# EAGLE design mc_board_with_leds (EAGLE 7.5.0)
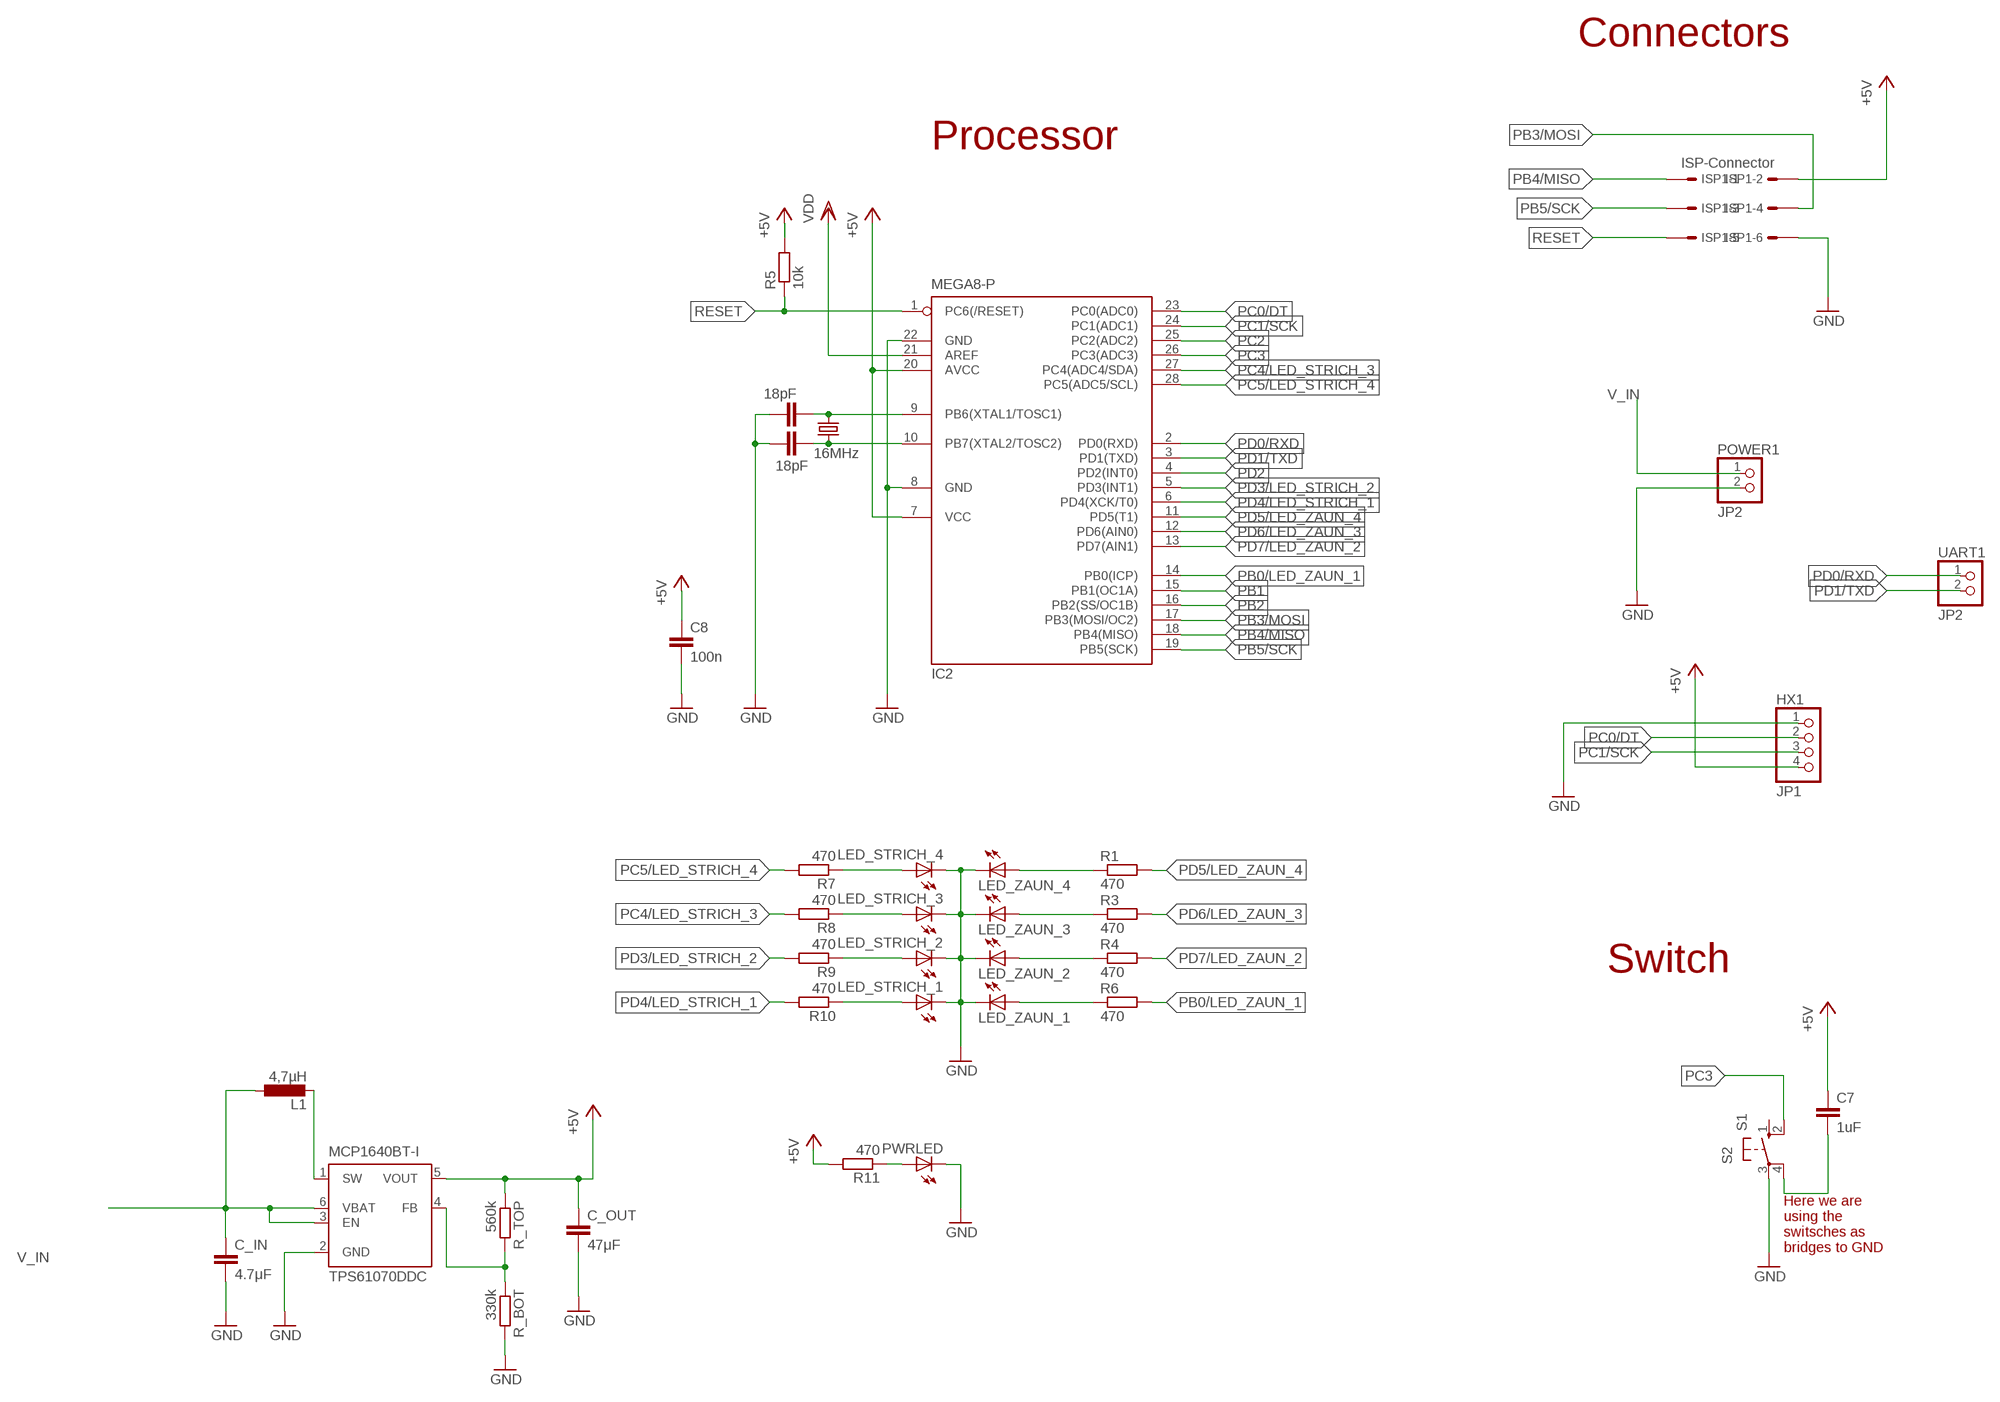
[diagram p0: schematic, sheet 1]

## Parts
C5  18pF  C-EUC0805K  [C0805K]
C6  18pF  C-EUC0805K  [C0805K]
C7  1uF  C-EUC0805  [C0805]
C8  100n  C-EUC0805  [C0805]
C_IN  4.7μF  C-EUC0805  [C0805]
C_OUT  47μF  C-EUC0805  [C0805]
HX1  JP1  PINHD-1X4  [1X04]
IC2  MEGA8-P  [DIL28-3]
ISP1  ISP-Connector  057-006-1  [057-006-1]
L1  4,7µH  L-EUL4532P  [L4532P]
LED_STRICH_1  LED3MM  [LED3MM]
LED_STRICH_2  LED3MM  [LED3MM]
LED_STRICH_3  LED3MM  [LED3MM]
LED_STRICH_4  LED3MM  [LED3MM]
LED_ZAUN_1  LED3MM  [LED3MM]
LED_ZAUN_2  LED3MM  [LED3MM]
LED_ZAUN_3  LED3MM  [LED3MM]
LED_ZAUN_4  LED3MM  [LED3MM]
MCP1640BT-I  TPS61070DDC  [TSOT23-6_DDC]
POWER1  JP2  PINHD-1X2  [1X02]
PWRLED  LED3MM  [LED3MM]
Q2  16MHz  CRYSTALHC49S  [HC49/S]
R1  470  R-EU_R0805  [R0805]
R3  470  R-EU_R0805  [R0805]
R4  470  R-EU_R0805  [R0805]
R5  10k  R-EU_R1206  [R1206]
R6  470  R-EU_R0805  [R0805]
R7  470  R-EU_R0805  [R0805]
R8  470  R-EU_R0805  [R0805]
R9  470  R-EU_R0805  [R0805]
R10  470  R-EU_R0805  [R0805]
R11  470  R-EU_R0805  [R0805]
R_BOT  330k  R-EU_R0805  [R0805]
R_TOP  560k  R-EU_R0805  [R0805]
S2  S1  10-XX  [B3F-10XX]
UART1  JP2  PINHD-1X2  [1X02]

## Nets
+5V: C7.1 C8.1 C_OUT.1 HX1.4 IC2.7(VCC) IC2.20(AVCC) ISP1.2 MCP1640BT-I.5(VOUT) R5.2 R11.2 R_TOP.1
GND: C5.2 C6.2 C8.2 C_IN.2 C_OUT.2 HX1.1 IC2.8(GND) IC2.22(GND) ISP1.6 LED_STRICH_1.K(C) LED_STRICH_2.K(C) LED_STRICH_3.K(C) LED_STRICH_4.K(C) LED_ZAUN_1.K(C) LED_ZAUN_2.K(C) LED_ZAUN_3.K(C) LED_ZAUN_4.K(C) MCP1640BT-I.2(GND) POWER1.2 PWRLED.K(C) R_BOT.2 S2.3(P)
N$1: LED_ZAUN_4.A R1.1
N$2: LED_ZAUN_3.A R3.1
N$3: LED_ZAUN_2.A R4.1
N$4: C5.1 IC2.10(PB7(XTAL2/TOSC2)) Q2.2
N$5: L1.2 MCP1640BT-I.1(SW)
N$6: MCP1640BT-I.4(FB) R_BOT.1 R_TOP.2
N$7: LED_ZAUN_1.A R6.1
N$8: LED_STRICH_4.A R7.1
N$10: LED_STRICH_3.A R8.1
N$11: LED_STRICH_2.A R9.1
N$12: LED_STRICH_1.A R10.1
N$13: PWRLED.A R11.1
N$14: C6.1 IC2.9(PB6(XTAL1/TOSC1)) Q2.1
N$15: C7.2 S2.4(P1)
PB0/LED_ZAUN_1: IC2.14(PB0(ICP)) R6.2
PB1: IC2.15(PB1(OC1A))
PB2: IC2.16(PB2(SS/OC1B))
PB3/MOSI: IC2.17(PB3(MOSI/OC2)) ISP1.4
PB4/MISO: IC2.18(PB4(MISO)) ISP1.1
PB5/SCK: IC2.19(PB5(SCK)) ISP1.3
PC0/DT: HX1.2 IC2.23(PC0(ADC0))
PC1/SCK: HX1.3 IC2.24(PC1(ADC1))
PC2: IC2.25(PC2(ADC2))
PC3: IC2.26(PC3(ADC3)) S2.2(S1)
PC4/LED_STRICH_3: IC2.27(PC4(ADC4/SDA)) R8.2
PC5/LED_STRICH_4: IC2.28(PC5(ADC5/SCL)) R7.2
PD0/RXD: IC2.2(PD0(RXD)) UART1.1
PD1/TXD: IC2.3(PD1(TXD)) UART1.2
PD2: IC2.4(PD2(INT0))
PD3/LED_STRICH_2: IC2.5(PD3(INT1)) R9.2
PD4/LED_STRICH_1: IC2.6(PD4(XCK/T0)) R10.2
PD5/LED_ZAUN_4: IC2.11(PD5(T1)) R1.2
PD6/LED_ZAUN_3: IC2.12(PD6(AIN0)) R3.2
PD7/LED_ZAUN_2: IC2.13(PD7(AIN1)) R4.2
RESET: IC2.1(PC6(/RESET)) ISP1.5 R5.1
V_IN: C_IN.1 L1.1 MCP1640BT-I.3(EN) MCP1640BT-I.6(VBAT) POWER1.1
VDD: IC2.21(AREF)
Unconnected: S2.1(S)

## Notes on the sheet
- Connectors
- Processor
- Switch
- Here we are
  using the 
  switsches as
  bridges to GND

## Library data of the parts
C5 C6 = resistor:C-EU: CAPACITOR, European symbol
C7 C8 C_IN C_OUT = rcl-2:C-EU: CAPACITOR, European symbol
HX1 = pinhead:PINHD-1X4: PIN HEADER
IC2 = atmel:MEGA8-P: MICROCONTROLLER 8 Kbytes FLASH, 1 kbytes SRAM, 512 bytes EEPROM, USART, 4-channel 10 bit ADC, 2-channel 8 bit ADC Pin compatible with Atmega48, ATMega88, ATMega168 Source: avr.lbr; OC_FARNELL: unknown; OC_NEWARK: unknown
ISP1 = con-panduit:057-006-: CONNECTOR 6-pin series 057 contact pc board low profile headers; OC_FARNELL: unknown; OC_NEWARK: unknown
L1 = rcl:L-EU: INDUCTOR, European symbol
LED_STRICH_1-LED_STRICH_4 LED_ZAUN_1-LED_ZAUN_4 PWRLED = led:LED: LED OSRAM: - CHIPLED LG R971, LG N971, LY N971, LG Q971, LY Q971, LO R971, LY R971 LH N974, LH R974 LS Q976, LO Q976, LY Q976 LO Q996 - Hyper CHIPLED LW Q18S LB Q993, LB Q99A, LB R99A - SideLED LS A670, LO A670, LY A670, LG A670, LP A670 LB A673, LV A673, LT A673, LW A673 LH A674 LY A675 LS A676, LA A676, LO A676, LY A676, LW A676 LS A679, LY A679, LG A679 - Hyper Micro SIDELED® LS Y876, LA Y876, LO Y876, LY Y876 LT Y87S - SmartLED LW L88C, LW L88S LB L89C, LB L89S, LG L890 LS L89K, LO L89K, LY L89K LS L896, LA L896, LO L896, LY L896 - TOPLED LS T670, LO T670, LY T670, LG T670, LP T670 LSG T670, LSP T670, LSY T670, LOP T670, LYG T670 LG T671, LOG T671, LSG T671 LB T673, LV T673, LT T673, LW T673 LH T674 LS T676, LA T676, LO T676, LY T676, LB T676, LH T676, LSB T676, LW T676 LB T67C, LV T67C, LT T67C, LS T67K, LO T67K, LY T67K, LW E67C LS E67B, LA E67B, LO E67B, LY E67B, LB E67C, LV E67C, LT E67C LW T67C LS T679, LY T679, LG T679 LS T770, LO T770, LY T770, LG T770, LP T770 LB T773, LV T773, LT T773, LW T773 LH T774 LS E675, LA E675, LY E675, LS T675 LS T776, LA T776, LO T776, LY T776, LB T776 LHGB T686 LT T68C, LB T68C - Hyper Mini TOPLED® LB M676 - Mini TOPLED Santana® LG M470 LS M47K, LO M47K, LY M47K Source: http://www.osram.convergy.de LUXEON: - LUMILED® LXK2-PW12-R00, LXK2-PW12-S00, LXK2-PW14-U00, LXK2-PW14-V00 LXK2-PM12-R00, LXK2-PM12-S00, LXK2-PM14-U00 LXK2-PE12-Q00, LXK2-PE12-R00, LXK2-PE12-S00, LXK2-PE14-T00, LXK2-PE14-U00 LXK2-PB12-K00, LXK2-PB12-L00, LXK2-PB12-M00, LXK2-PB14-N00, LXK2-PB14-P00, LXK2-PB14-Q00 LXK2-PR12-L00, LXK2-PR12-M00, LXK2-PR14-Q00, LXK2-PR14-R00 LXK2-PD12-Q00, LXK2-PD12-R00, LXK2-PD12-S00 LXK2-PH12-R00, LXK2-PH12-S00 LXK2-PL12-P00, LXK2-PL12-Q00, LXK2-PL12-R00 Source: www.luxeon.com KINGBRIGHT: KA-3528ASYC Source: www.kingbright.com
MCP1640BT-I = texas:TPS6107*: 90% EFFICIENT SYNCHRONOUS BOOST CONVERTER WITH 600-mA SWITCH Source: http://focus.ti.com/lit/ds/symlink/tps61070.pdf; MPN: TPS61070DDCR; OC_FARNELL: 1461062; OC_NEWARK: 64M3125
POWER1 UART1 = pinhead:PINHD-1X2: PIN HEADER
Q2 = crystal:CRYSTAL: CRYSTAL; OC_FARNELL: 1667008; OC_NEWARK: unknown
R1 R3 R4 R6-R11 R_BOT R_TOP = resistor:R-EU_: RESISTOR, European symbol
R5 = rcl-2:R-EU_: RESISTOR, European symbol
S2 = switch-omron:10-XX: OMRON SWITCH; MPN: B3F-1000; OC_FARNELL: 176432; OC_NEWARK: 36M3542

## Board
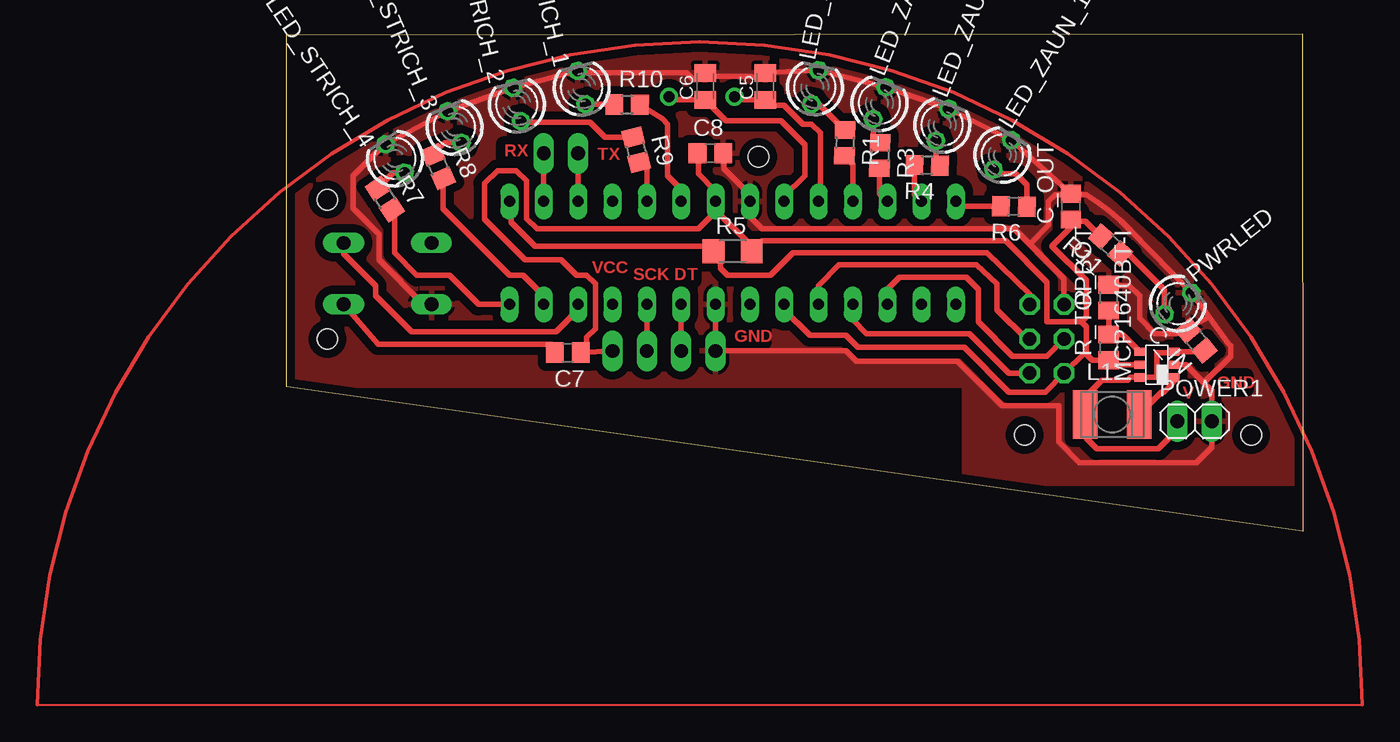
[diagram p1: board, top side]
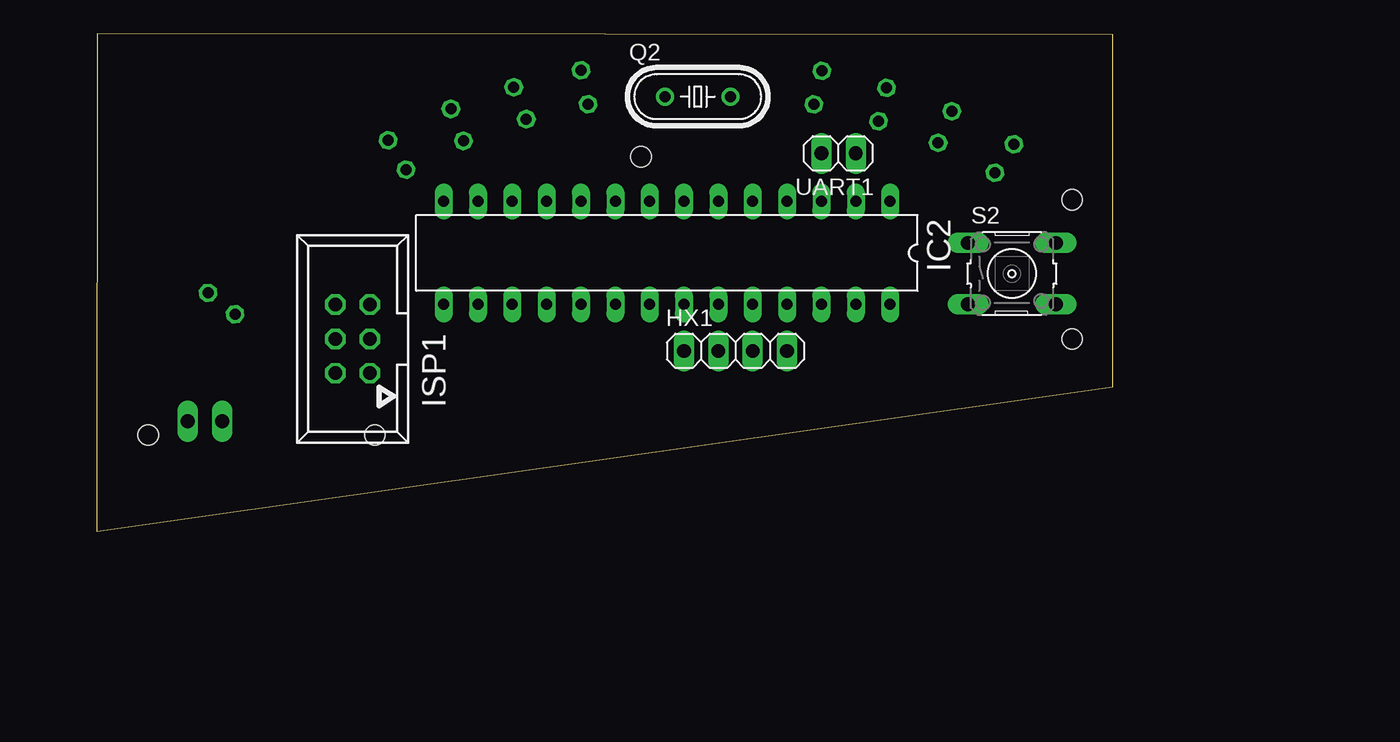
[diagram p2: board, bottom side, seen from below]

Size 75.15 x 36.76 mm. Coordinates in mm from the lower left corner, seen from the top.
Outline: 0,10.66 0.02,36.68 75.12,36.76 75.15,0 0,10.66
Copper layers (1*16): Top 0.035mm / dielectric 1.5mm / Bottom 0.035mm
Design rules "default *": minimum track width 10mil, minimum drill 24mil, track to track 8mil, track to pad 8mil, pad to pad 8mil, via to via 8mil, smd to smd 8mil, copper to edge 25mil, drill to drill 8mil, minimum pad ring 10mil, minimum via ring 8mil, stop-mask expansion 4mil, vias tented up to drill 0mil, thermal gap 10mil
Holes 1.5 mm at 3.02,24.5 71.35,7.1 54.58,7.1 3.02,14.21 34.9,27.67

### Footprints (pad centres in the part's own frame; a part is rotated, then mirrored left to right if it is on the bottom)
C0805K = smd 1.3 x 1.6: 1 -1,0; 2 1,0
C0805 = smd 1.3 x 1.5: 1 -0.95,0; 2 0.95,0
1X04 = drill 1.016 long: 1 -3.81,0; 2 -1.27,0; 3 1.27,0; 4 3.81,0
DIL28-3 = drill 0.813 long: 1 -16.51,-3.81; 2 -13.97,-3.81; 3 -11.43,-3.81; 4 -8.89,-3.81; 5 -6.35,-3.81; 6 -3.81,-3.81; 7 -1.27,-3.81; 8 1.27,-3.81; 9 3.81,-3.81; 10 6.35,-3.81; 11 8.89,-3.81; 12 11.43,-3.81; 13 13.97,-3.81; 14 16.51,-3.81; 15 16.51,3.81; 16 13.97,3.81; 17 11.43,3.81; 18 8.89,3.81; 19 6.35,3.81; 20 3.81,3.81; 21 1.27,3.81; 22 -1.27,3.81; 23 -3.81,3.81; 24 -6.35,3.81; 25 -8.89,3.81; 26 -11.43,3.81; 27 -13.97,3.81; 28 -16.51,3.81
057-006-1 = drill 1 octagon: 1 -2.54,-1.27; 2 -2.54,1.27; 3 0,-1.27; 4 0,1.27; 5 2.54,-1.27; 6 2.54,1.27
L4532P = smd 1.8 x 3.6: 1 -2,0; 2 2,0
LED3MM = drill 0.813 octagon: A -1.27,0; K 1.27,0
TSOT23-6_DDC = smd 0.6 x 0.8: 1 -0.95,-1.25; 2 0,-1.25; 3 0.95,-1.25; 4 0.95,1.25; 5 0,1.25; 6 -0.95,1.25
1X02 = drill 1.016 long: 1 -1.27,0; 2 1.27,0
HC49/S = drill 0.813: 1 2.413,0; 2 -2.413,0
R0805 = smd 1.3 x 1.5: 1 -0.95,0; 2 0.95,0
R1206 = smd 1.6 x 1.803: 1 -1.422,0; 2 1.422,0
B3F-10XX = drill 1.016 long: 1 -3.251,2.261; 2 3.251,2.261; 3 -3.251,-2.261; 4 3.251,-2.261

### Placement (x,y rotation side)
C5  35.41,32.88 90 top
C6  30.96,32.88 90 top
C7  20.8,13.19 180 top
C8  31.34,27.93 0 top
C_IN  67.28,14.08 130 top
C_OUT  58.01,23.99 90 top
HX1  27.91,13.32 0 bottom
IC2  32.99,20.56 180 bottom
ISP1  56.24,14.21 90 bottom
L1  61.06,8.62 0 top
LED_STRICH_1  21.83,32.78 103.6 top
LED_STRICH_2  17.04,31.53 103.6 top
LED_STRICH_3  12.42,29.87 113.6 top
LED_STRICH_4  8.02,27.54 123.6 top
LED_ZAUN_1  52.95,27.81 58.6 top
LED_ZAUN_2  48.5,30.03 68.6 top
LED_ZAUN_3  43.86,31.64 68.6 top
LED_ZAUN_4  39.08,32.82 78.6 top
MCP1640BT-I  64.36,12.31 90 top
POWER1  67.16,8.11 0 top
PWRLED  65.93,16.82 38.6 top
Q2  30.71,32.12 0 bottom
R1  41.28,28.7 268.6 top
R3  43.88,27.77 268.6 top
R4  47.37,27.04 178.6 top
R5  32.99,20.69 0 top
R6  53.79,24 178.6 top
R7  7.27,24.55 303.6 top
R8  11.2,26.96 293.6 top
R9  25.86,28.19 283.6 top
R10  25.19,31.53 359.6 top
R11  60.94,21.15 138.6 top
R_BOT  60.81,17.26 90 top
R_TOP  60.81,13.58 90 top
S2  7.47,19.04 0 bottom
UART1  20.29,27.93 180 bottom

### Tracks (layer width: path | path; a pad name or v marks a point on that pad's centre or on a via)
+5V
  Top 0.406: 31.72,23.61 IC2.7 31.72,25.13 30.45,26.4 30.45,27.99 C8.1 | 58.78,15.48 56.24,15.48 56.24,18.4 53.19,21.45 35.18,21.45 R5.2 34.14,20.97 34.01,21.45 31.85,23.61 31.72,23.61 | 58.78,15.48 59.16,15.1 59.16,13.32 59.03,13.19 | 59.03,13.19 ISP1.2 56.11,10.27 53.44,10.27 50.14,13.58 42.27,13.58 41.38,14.46 38.71,14.46 36.8,16.37 IC2.20 | HX1.4 C7.1 22.2,13.26 22.2,14.34 22.83,14.97 22.83,18.27 22.2,18.91 21.44,18.91 20.29,20.05 17.63,20.05 14.64,23.04 14.64,25.7 15.6,26.66 16.99,26.66 17.75,25.89 17.75,23.1 18.52,22.34 30.45,22.34 31.72,23.61 | 58.78,15.48 59.16,15.86 59.16,18.53 56.62,21.07 58.01,22.47 C_OUT.1 58.14,22.91 59.09,22.91 R11.2 | MCP1640BT-I.5 63.05,12.24 62.99,12.31 61.19,12.31 60.87,12.63 R_TOP.1 59.6,12.63 59.03,13.19
GND
  Top 0.406: S2.3 10.11,16.78 6.83,20.05 6.83,21.96 4.93,23.86 4.93,26.28 7.25,28.6 LED_STRICH_4.K LED_STRICH_3.K LED_STRICH_2.K LED_STRICH_1.K 21.65,33.9 29.57,33.9 30.09,33.37 C6.2 31.49,33.64 34.26,33.64 34.79,33.5 C5.2 LED_ZAUN_4.K LED_ZAUN_3.K LED_ZAUN_2.K LED_ZAUN_1.K C_OUT.2 57.12,24.88 | IC2.22 HX1.1 41.38,13.32 42.14,12.56 49.63,12.56 52.93,9.26 57.12,9.26 57.12,6.59 58.65,5.07 67.28,5.07 68.43,6.21 POWER1.2 68.43,10.4 67.86,10.97 | 54.97,21.2 53.82,22.34 35.15,22.34 34.26,23.23 IC2.8 34.26,24.88 32.36,26.78 32.36,27.99 | 54.97,21.2 57.51,18.66 ISP1.6 | 54.97,21.2 56.36,22.59 56.36,24.37 56.87,24.88 57.12,24.88 | 65.76,14.59 64.24,14.59 63.09,15.73 63.09,17.39 62.33,18.15 60.87,18.15 R_BOT.2 | MCP1640BT-I.2 66.52,12.31 67.86,10.97 | 68.24,15.81 PWRLED.K 62.46,22.21 arc14 59.16,24.88 57.12,24.88 | 68.24,15.81 69.7,13.83 69.82,13.7 69.82,12.94 67.86,10.97 | 65.76,14.59 C_IN.2 | 65.76,14.59 68.24,15.81
  pour Top (isolate 0.61): 49.63,10.78 0.23,10.78 0.23,25.39 5.44,29.2 12.93,32.75 21.44,35.17 28.17,35.93 35.41,35.67 41,34.78 48.36,32.63 54.97,29.45 60.93,25.39 65.38,21.32 69.57,16.75 73,11.67 74.9,7.86 74.9,3.54 50.52,3.54 50.14,3.54 50.14,10.78
N$1
  Top 0.406: LED_ZAUN_4.A 39.39,31.57 R1.1
N$2
  Top 0.406: R3.1 43.39,29.22 LED_ZAUN_3.A
N$3
  Top 0.406: R4.1 48.03,27.31 LED_ZAUN_2.A
N$4
  Top 0.406: IC2.10 39.47,24.5 39.47,29.45 38.84,30.09 38.2,30.09 36.8,31.48 35.42,31.48 C5.1 33.36,31.88 Q2.2
N$5
  Top 0.406: MCP1640BT-I.1 65.63,11.34 65.63,11.04 64.87,10.27 64.71,10.27 L1.2
N$6
  Top 0.406: R_BOT.1 R_TOP.2 61.84,14.53 MCP1640BT-I.4
N$7
  Top 0.406: R6.1 54.74,25.61 53.95,26.4 52.61,26.4 LED_ZAUN_1.A
N$8
  Top 0.406: LED_STRICH_4.A 7.88,26.48 R7.1
N$9
  Top 0.254: -18.44,-12.84 arc-180 79.56,-12.84
N$10
  Top 0.406: LED_STRICH_3.A 11.7,28.71 R8.1
N$11
  Top 0.406: LED_STRICH_2.A 17.42,30.21 22.45,30.21 23.55,29.12 R9.1
N$12
  Top 0.406: LED_STRICH_1.A R10.1
N$13
  Top 0.406: PWRLED.A 64.93,17.83 62.25,20.52 R11.1
N$14
  Top 0.406: Q2.1 28.53,31.88 C6.1 32.5,30.34 36.55,30.34 38.33,28.56 38.33,26.28 36.8,24.75 IC2.9
N$15
  Top 0.406: S2.4 6.78,13.83 19.6,13.83 C7.2
PB0/LED_ZAUN_1
  Top 0.406: IC2.14 49.86,24.02 R6.2
PB3/MOSI
  Top 0.406: IC2.17 44.42,17.89 45.31,18.78 50.27,18.78 51.16,17.89 51.16,15.48 53.7,12.94 56.24,12.94 ISP1.4
PB4/MISO
  Top 0.406: ISP1.1 53.44,11.67 50.52,14.59 42.9,14.59 41.88,15.61 IC2.18
PB5/SCK
  Top 0.406: IC2.19 39.34,18.15 40.87,19.67 51.03,19.67 52.55,18.27 52.55,16.37 54.71,14.21 ISP1.3
PC0/DT
  Top 0.406: HX1.2 IC2.23
PC1/SCK
  Top 0.406: HX1.3 IC2.24
PC3
  Top 0.406: IC2.26 21.56,16.37 19.91,14.72 9.25,14.72 6.58,17.39 6.58,18.15 4.22,20.51 S2.2
PC4/LED_STRICH_3
  Top 0.406: IC2.27 19.02,17.39 17.5,18.91 16.48,18.91 11.58,23.81 R8.2
PC5/LED_STRICH_4
  Top 0.406: IC2.28 14.2,16.75 12.04,18.91 9.63,18.91 7.98,20.56 7.98,23.3 R7.2
PD0/RXD
  Top 0.406: IC2.2 UART1.1
PD1/TXD
  Top 0.406: IC2.3 UART1.2
PD3/LED_STRICH_2
  Top 0.406: IC2.5 26.64,24.88 26.64,25.56 26.64,26.71 R9.2
PD4/LED_STRICH_1
  Top 0.406: R10.2 27.79,30.47 28.17,30.09 28.17,26.28 28.93,25.51 28.93,24.62 IC2.6
PD5/LED_ZAUN_4
  Top 0.406: IC2.11 41.88,27.13 R1.2
PD6/LED_ZAUN_3
  Top 0.406: IC2.12 43.85,24.94 R3.2
PD7/LED_ZAUN_2
  Top 0.406: IC2.13 46.42,24.91 R4.2
RESET
  Top 0.406: IC2.1 16.61,24.37 16.61,22.85 18.39,21.07 31.19,21.07 R5.1 32.11,20.15 32.11,19.42 32.61,18.91 35.79,18.91 37.44,20.56 51.79,20.56 54.97,17.51 ISP1.5
V_IN
  Top 0.406: POWER1.1 65.89,7.48 64.49,6.08 59.92,6.08 59.16,6.84 59.16,8.53 L1.1 59.28,8.84 59.28,10.15 60.3,11.16 62.2,11.16 62.4,11.36 MCP1640BT-I.6 64.36,11.36 64.36,13.19 65.61,13.19 MCP1640BT-I.3 68.01,13.26 C_IN.1
(copper drawn outside any net)
  shapes: Top area x1

### Text on the board
Top: RX | TX | VCC | SCK | DT | GND | V | GND